# EasyEDA schematic SCH_PCB-BRAILLE-FX_2026-09-07.json
TITLE: Sheet_1; REV: 1.0; Date: 2026-07-28; Sheet: 1/1; Drawn By: 24050874058; Company: Your Company

## Parts
J1  TFT-HDR  [HDR-M-2.54_1X15]
J2  PUSH BUTTON  [HDR-M-2.54_2X10]
J4  5V  [TERMINALBLOCK:TERMINALBLOCK_MAIXU_MX126-5.0-02P_1X02_P5.00MM]
J5  AMP  [TERMINALBLOCK:TERMINALBLOCK_MAIXU_MX126-5.0-02P_1X02_P5.00MM]
M1  PCM5102-I2S-MOD  [PCM5102-I2S-MOD]
MODULE1  CJMCU-2317 MCP23017 I2C  [CJMCU-2317 MCP23017 I2C SERIAL INTERFACE 16 BIT I/O EXPANDER SERIAL MODULE]
U1  ARDUINO_NANO  [COMM-TH_ARDUINO_NANO]
U2  4_CHANNEL_LLC  [4 CHANNEL LOGIC LEVEL SHIFTER]
U3  ESP32-S3  [ESP32S3-DEVKIT-C1-V10]
U4  LM2596_MODULE_STEPDOWN 5V  [LM2596-STEPDOWN-MODULE_IG_BO]

## Library data of the parts
J1 = HDR-M-2.54_1x15: Supplier Part: C124373; Supplier: LCSC; Contributor: LCEDA_Lib
J2 = HDR-M-2.54_2x10: Supplier Part: C124359; Supplier: LCSC; Contributor: LCEDA_Lib
J4 J5 = Connector_Screw_Terminal_01x02: Attribute1: J20; Add into BOM: yes; Convert to PCB: yes; Origin Footprint: TerminalBlock:TerminalBlock_MaiXu_MX126-5.0-02P_1x02_P5.00mm; Contributor: aironmasa
M1 = PCM5102-I2S-MOD: Contributor: steve45
MODULE1 = CJMCU-2317 MCP23017 I2C Serial Interface 16 bit I/O Expander Serial Module: Contributor: ondra.lie
U1 = ARDUINO_NANO: Contributor: lcsc; Supplier: LCSC; Supplier Part: C9900017879; Manufacturer: null; JLCPCB Part Class: Extended Part
U2 = 4_CHANNEL_LLC: Contributor: gialamed
U3 = ESP32-S3: Contributor: huydoquang5204; Supplier: WeAct
U4 = LM2596-Module-Schematic: Contributor: Fazri

## Nets
+3V3: J1.14 M1.VCC M1.XSMT MODULE1.30(VCC) U2.3(LV) U3.3.3V_1(3.3V)
+5V: J1.7 U1.27(+5V) U2.10(HV) U4.4(Out +)
+12V: U4.1(In +)
GND: J1.13 J2.20 M1.AGND2 M1.DEMP M1.FLT M1.FMT M1.GND M1.SCK MODULE1.29(GND) U1.29(GND) U2.9(GND) U3.G3(GND)
+: J5.1(Pin)
-: J5.2(Pin)
A0: J2.9 MODULE1.3(A0)
A1: J2.10 MODULE1.4(A1)
A2: J2.11 MODULE1.5(A2)
A3: J2.12 MODULE1.6(A3)
A4: J2.13 MODULE1.7(A4)
A5: J2.14 MODULE1.8(A5)
A6: J2.15 MODULE1.9(A6)
A7: J2.16 MODULE1.10(A7)
B0: J2.1 MODULE1.13(B0)
B1: J2.2 MODULE1.14(B1)
B2: J2.3 MODULE1.15(B2)
B3: J2.4 MODULE1.16(B3)
B4: J2.5 MODULE1.17(B4)
B5: J2.6 MODULE1.18(B5)
B6: J2.7 MODULE1.19(B6)
B7: J2.8 MODULE1.20(B7)
BCLK: M1.BCK U3.5(GPIO5)
D2: U1.5(D2)
D3: U1.6(D3)
D4: U1.7(D4)
D5: U1.8(D5)
D6: U1.9(D6)
D7: U1.10(D7)
DOUT: M1.DIN U3.7(GPIO7)
LOUT: M1.LOUT
LRC: M1.LRCK U3.6(GPIO6)
ROUT: M1.ROUT
SCL/SCK: MODULE1.28(SCL/SCK) U3.9(GPIO9)
SDA/SI: MODULE1.27(SDA/SI) U3.8(GPIO8)
TFT_BL: U3.10(GPIO10)
TFT_CS: J1.12 U3.15(GPIO15)
TFT_DC: J1.10 U3.2(GPIO2)
TFT_RST: J1.11 U3.4(GPIO4)
TFT_SCK: J1.8
TFT_SCLK: J1.5 U3.18(GPIO18)
TFT_SDI(MOSI): J1.3 J1.9 U3.11(GPIO11)
TFT_SDO(MISO): J1.2 J1.6 U3.13(GPIO13)
TOUCH_CS: J1.4 U3.14(GPIO14)
TOUCH_IRQ: J1.1 U3.12(GPIO12)
Net-(U1-13): U1.13(D10) U2.11(HV2)
Net-(U1-14): U1.14(D11) U2.12(HV1)
Net-(U2-1): U2.1(LV1) U3.42(GPIO42)
Net-(U2-2): U2.2(LV2) U3.41(GPIO41)

Not connected (* = marked no-connect by the designer): J1 15; J2 17 18 19; J4 1(Pin) 2(Pin); M1 A3V3 AGND1; MODULE1 1(GND) 2(ITA) 11(VCC) 12(ITB) 21(X2) 22(X1) 23(X0) 24(RESET) 25(NC/S0) 26(NC/CS); U1 1(D1/TX) 2(D0/RX) 3(RESET) 4(GND) 11(D8) 12(D9) 15(D12) 16(D13) 17(3V3) 18(AREF) 19(A0) 20(A1) 21(A2) 22(A3) 23(A4) 24(A5) 25(A6) 26(A7) 28(RESET) 30(VIN); U2 4(GND) 5(LV3) 6(LV4) 7(HV4) 8(HV3); U3 0(GPIO0) 1(GPIO1) 3(GPIO3) 3.3V_2(3.3V) 5V 16(GPIO16) 17(GPIO17) 19(GPIO19) 20(GPIO20) 21(GPIO21) 35(GPIO35) 36(GPIO36) 37(GPIO37) 38(GPIO38) 39(GPIO39) 40(GPIO40) 45(GPIO45) 46(GPIO46) 47(GPIO47) 48(GPIO48) G1(GND) G2(GND) G4(GND) RST RX TX; U4 2(In -) 3(Out -)
